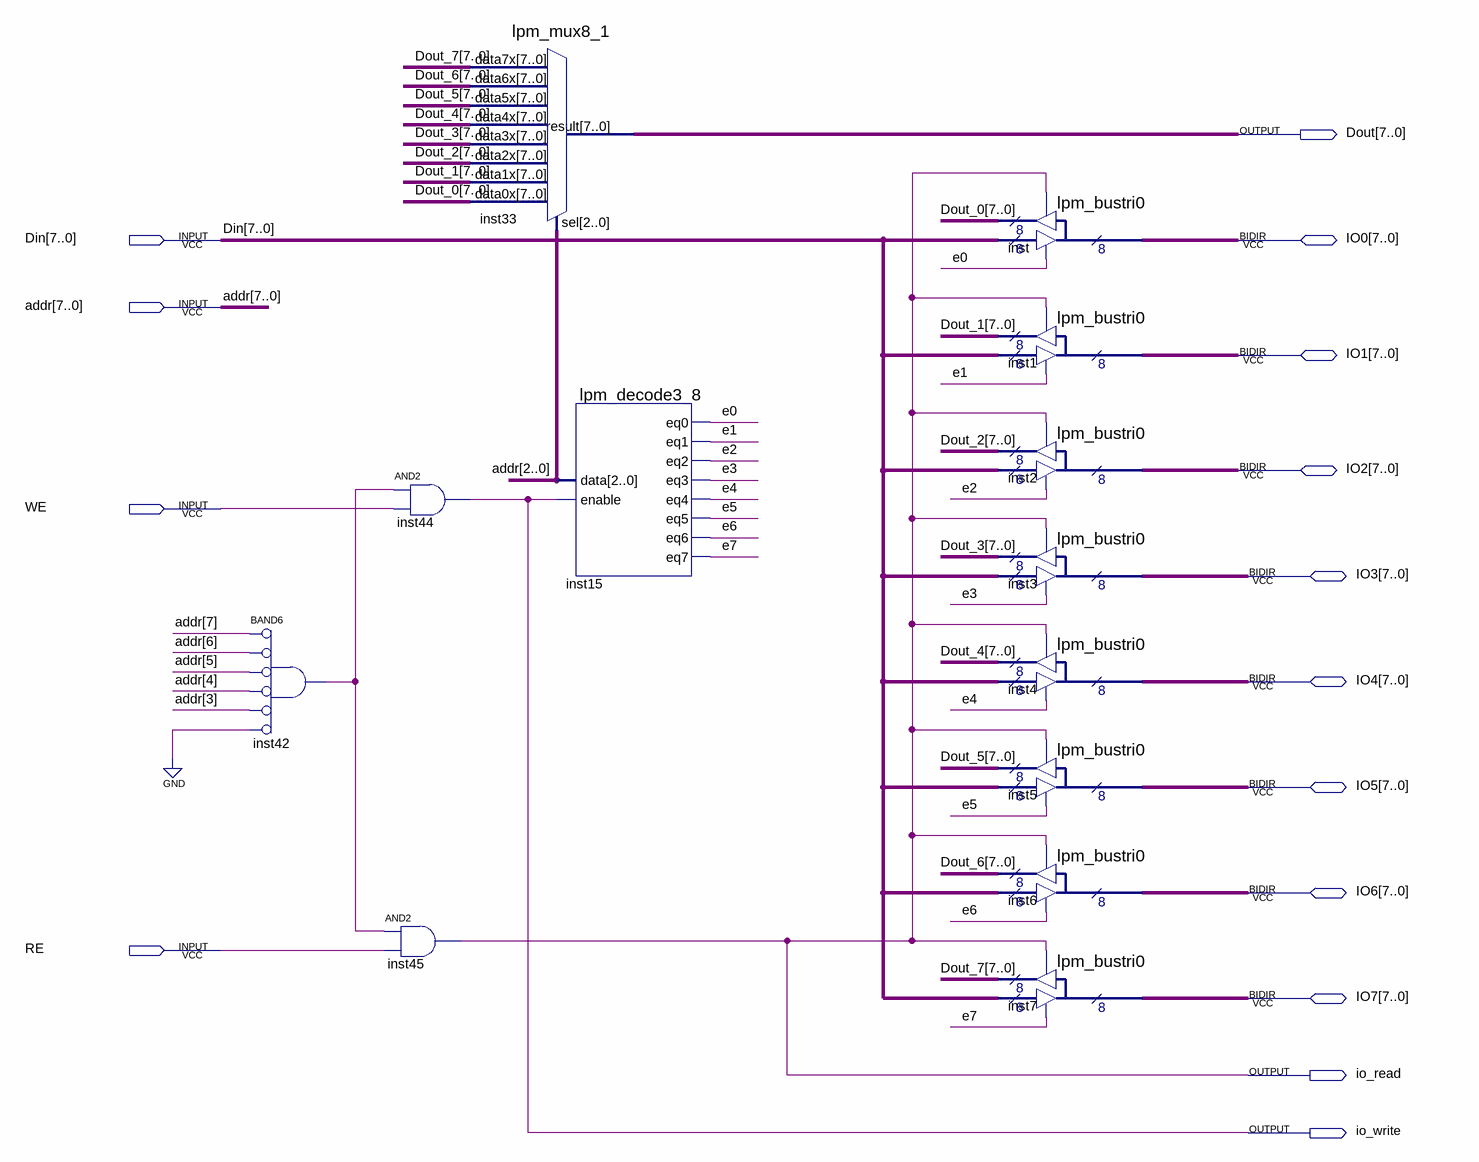
[diagram p0: schematic sheet]
// Quartus schematic IO_PORT.bdf as structural Verilog: 13 symbols, 15 pins
module IO_PORT (
  input  [7:0] Din,
  input  [7:0] addr,
  input  WE,
  input  RE,
  inout  [7:0] IO0,
  inout  [7:0] IO1,
  inout  [7:0] IO2,
  inout  [7:0] IO3,
  inout  [7:0] IO4,
  inout  [7:0] IO5,
  inout  [7:0] IO6,
  inout  [7:0] IO7,
  output [7:0] Dout,
  output io_read,
  output io_write
);

  wire e0, e1, e2, e3, e4, e5, e6, e7, inst42_out;
  wire [7:0] Dout_0, Dout_1, Dout_2, Dout_3, Dout_4, Dout_5, Dout_6, Dout_7;

  and inst42 (inst42_out, ~addr[7], ~addr[6], ~addr[5], ~addr[4], ~addr[3], ~1'b0);  // BAND6
  and inst44 (io_write, inst42_out, WE);
  and inst45 (io_read, inst42_out, RE);
  lpm_mux8_1 inst33 (
    .data7x(Dout_7), .data6x(Dout_6), .data5x(Dout_5), .data4x(Dout_4), .data3x(Dout_3), .data2x(Dout_2),
    .data1x(Dout_1), .data0x(Dout_0), .sel(addr[2:0]), .result(Dout));
  lpm_decode3_8 inst15 (
    .data(addr[2:0]), .enable(io_write), .eq0(e0), .eq1(e1), .eq2(e2), .eq3(e3), .eq4(e4), .eq5(e5),
    .eq6(e6), .eq7(e7));
  lpm_bustri0 inst (.enabledt(e0), .data(Din), .enabletr(io_read), .result(Dout_0), .tridata(IO0));
  lpm_bustri0 inst1 (.enabledt(e1), .data(Din), .enabletr(io_read), .result(Dout_1), .tridata(IO1));
  lpm_bustri0 inst2 (.enabledt(e2), .data(Din), .enabletr(io_read), .result(Dout_2), .tridata(IO2));
  lpm_bustri0 inst3 (.enabledt(e3), .data(Din), .enabletr(io_read), .result(Dout_3), .tridata(IO3));
  lpm_bustri0 inst4 (.enabledt(e4), .data(Din), .enabletr(io_read), .result(Dout_4), .tridata(IO4));
  lpm_bustri0 inst5 (.enabledt(e5), .data(Din), .enabletr(io_read), .result(Dout_5), .tridata(IO5));
  lpm_bustri0 inst6 (.enabledt(e6), .data(Din), .enabletr(io_read), .result(Dout_6), .tridata(IO6));
  lpm_bustri0 inst7 (.enabledt(e7), .data(Din), .enabletr(io_read), .result(Dout_7), .tridata(IO7));
endmodule
